# Altium schematic sheet Button.SchDoc
size A4; SheetNumber: 5; SheetTotal: 5
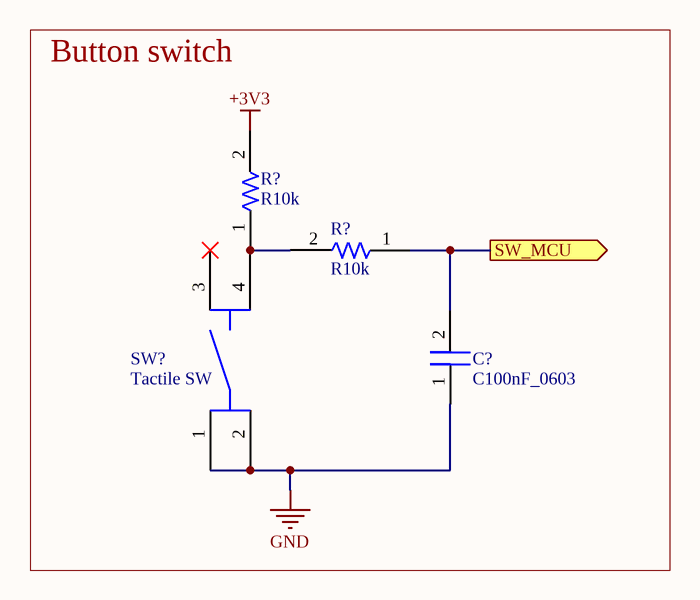
[diagram p0: Button.SchDoc]

## Parts
(Parts that share a designator on the sheet are numbered #1, #2 ... from top to bottom, then left to right.)
C?  C100nF_0603  [Chip2PinSM127P600-8N]
R?#1  R10k  [R0603]
R?#2  R10k  [R0603]
SW?  Tactile SW  [SW_2-1437565-7]

## Blocks framed on the sheet
Button switch: C? R?#1 R?#2 SW?

## Ports
SW_MCU (out)

## Nets
+3V3: R?#1.2
GND: C?.1 SW?.1 SW?.2
SW_MCU: C?.2 R?#2.1 ; port SW_MCU
NetR?#1_1: R?#1.1 R?#2.2 SW?.4

Not connected (* = marked no-connect by the designer): SW? 3*

## Library data of the parts
R?#1 R?#2 = R10k_0603
SW? = SW_6x6